# Altium schematic sheet Power.SchDoc
size 420 x 297 mm; DocumentNumber: Power supply
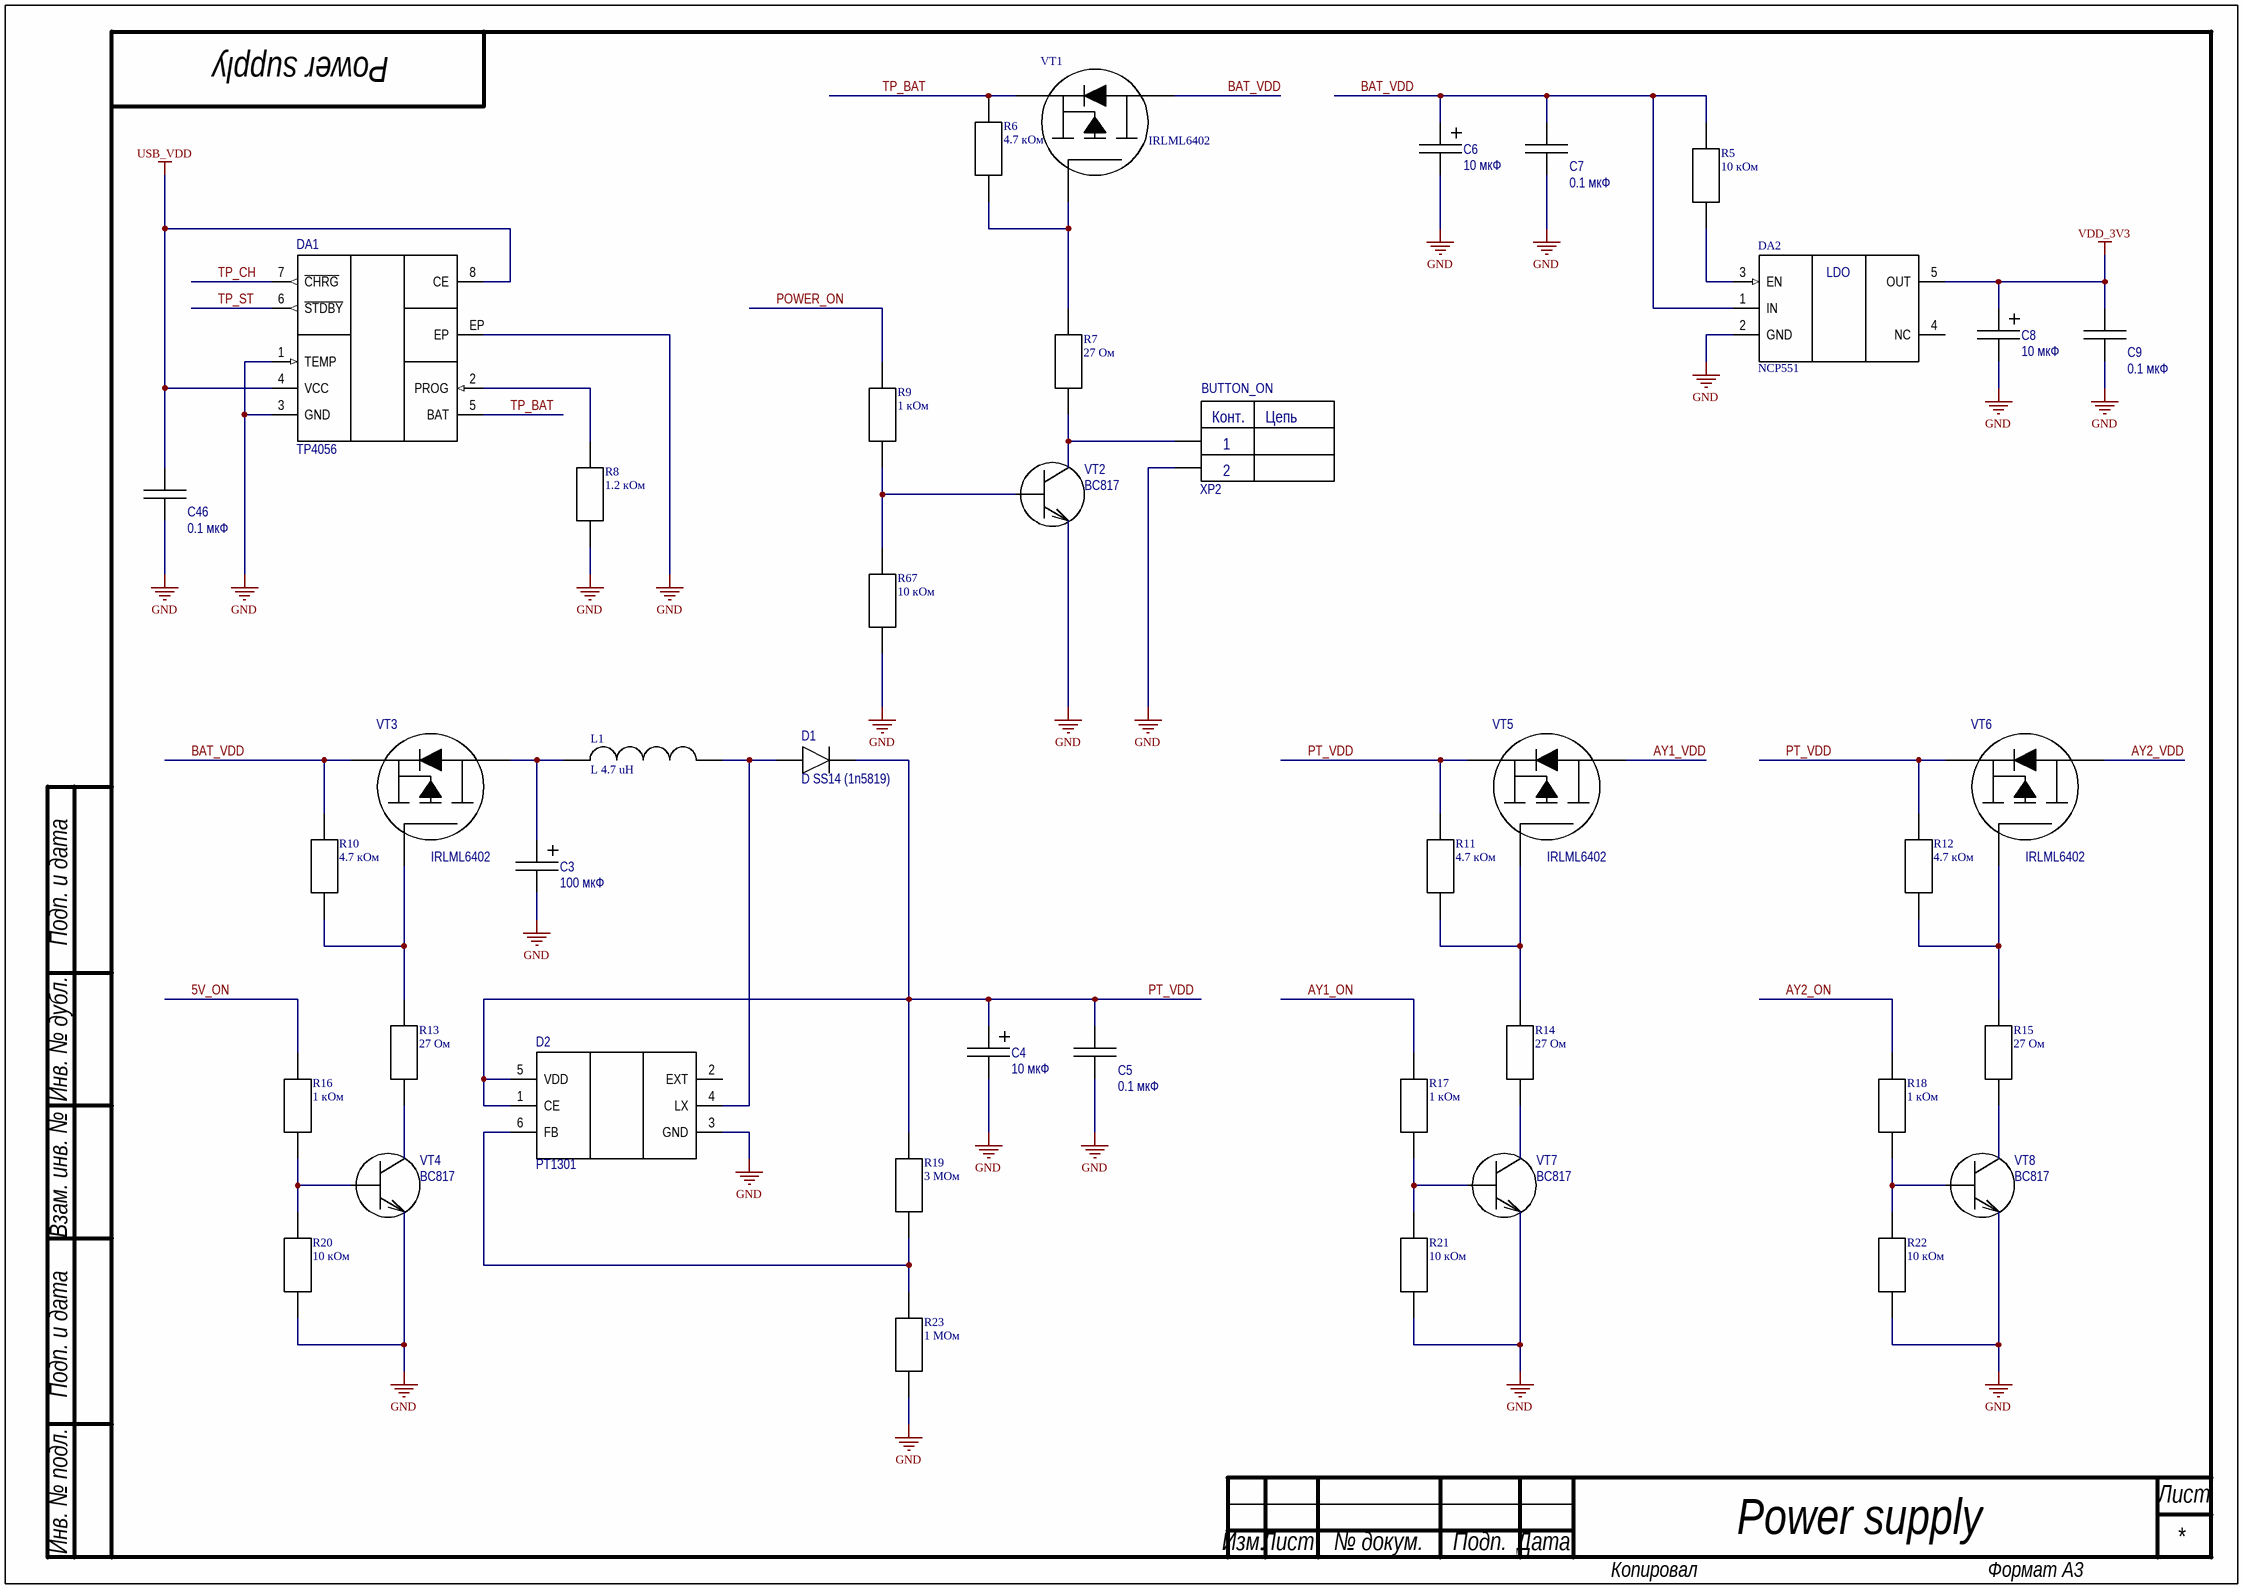
[diagram p0: Power.SchDoc]

## Parts
C3  100 мкФ  [C TAN_D]
C4  10 мкФ  [C TAN_C]
C5  0.1 мкФ  [C 1206]
C6  10 мкФ  [C TAN_C]
C7  0.1 мкФ  [C 1206]
C8  10 мкФ  [C TAN_C]
C9  0.1 мкФ  [C 1206]
C46  0.1 мкФ  [C 1206]
D1  D SS14 (1n5819)  [SMA/DO-214AC]
D2  PT1301  [SOT-23-6]
DA1  TP4056  [HSOP-8]
DA2  NCP551  [TSOP-5]
L1  L 4.7 uH  [CD43]
R5  10 кОм  [RES 0805]
R6  4.7 кОм  [RES 0805]
R7  27 Ом  [RES 0805]
R8  1.2 кОм  [RES 0805]
R9  1 кОм  [RES 0805]
R10  4.7 кОм  [RES 0805]
R11  4.7 кОм  [RES 0805]
R12  4.7 кОм  [RES 0805]
R13  27 Ом  [RES 0805]
R14  27 Ом  [RES 0805]
R15  27 Ом  [RES 0805]
R16  1 кОм  [RES 0805]
R17  1 кОм  [RES 0805]
R18  1 кОм  [RES 0805]
R19  3 МОм  [RES 0805]
R20  10 кОм  [RES 0805]
R21  10 кОм  [RES 0805]
R22  10 кОм  [RES 0805]
R23  1 МОм  [RES 0805]
R67  10 кОм  [RES 0805]
VT1  IRLML6402  [SOT-23]
VT2  BC817  [SOT-23]
VT3  IRLML6402  [SOT-23]
VT4  BC817  [SOT-23]
VT5  IRLML6402  [SOT-23]
VT6  IRLML6402  [SOT-23]
VT7  BC817  [SOT-23]
VT8  BC817  [SOT-23]
XP2  PLS-2  [PLS-2]  (value not drawn)

## Nets
GND: C3.2 C4.2 C5.2 C6.2 C7.2 C8.2 C9.2 C46.2 D2.3(GND) DA1.1(TEMP) DA1.3(GND) DA1.EP DA2.2(GND) R8.1 R20.1 R21.1 R22.1 R23.1 R67.1 VT2.2(E) VT4.2(E) VT7.2(E) VT8.2(E) XP2.2
USB_VDD: C46.1 DA1.4(VCC) DA1.8(CE)
VDD_3V3: C8.1 C9.1 DA2.5(OUT)
5V_ON: R16.2
AY1_ON: R17.2
AY1_VDD: VT5.3(D)
AY2_ON: R18.2
AY2_VDD: VT6.3(D)
BAT_VDD: C6.1 C7.1 DA2.1(IN) R5.2 R10.2 VT1.3(D) VT3.2(S)
POWER_ON: R9.2
PT_VDD: C4.1 C5.1 D1.C D2.1(CE) D2.5(VDD) R11.2 R12.2 R19.2 VT5.2(S) VT6.2(S)
TP_BAT: DA1.5(BAT) R6.2 VT1.2(S)
TP_CH: DA1.7(~{CHRG})
TP_ST: DA1.6(~{STDBY})
NetC3_1: C3.1 L1.1 VT3.3(D)
NetD1_A: D1.A D2.4(LX) L1.2
NetD2_6: D2.6(FB) R19.1 R23.2
NetDA1_2: DA1.2(PROG) R8.2
NetDA2_3: DA2.3(EN) R5.1
NetR6_1: R6.1 R7.2 VT1.1(G)
NetR7_1: R7.1 VT2.3(C) XP2.1
NetR9_1: R9.1 R67.2 VT2.1(B)
NetR10_1: R10.1 R13.2 VT3.1(G)
NetR11_1: R11.1 R14.2 VT5.1(G)
NetR12_1: R12.1 R15.2 VT6.1(G)
NetR13_1: R13.1 VT4.3(C)
NetR14_1: R14.1 VT7.3(C)
NetR15_1: R15.1 VT8.3(C)
NetR16_1: R16.1 R20.2 VT4.1(B)
NetR17_1: R17.1 R21.2 VT7.1(B)
NetR18_1: R18.1 R22.2 VT8.1(B)

Not connected (* = marked no-connect by the designer): D2 2(EXT); DA2 4(NC)

## Notes on the sheet
- (near XP2) BUTTON_ON
- Подп. и дата
- Инв. № дубл.
- Взам. инв. №
- Инв. № подл.
- Лист
- Изм.
- № докум.
- Подп.
- Дата
- Копировал
- Формат А3
- (in symbol NCP551) LDO
- (in symbol PLS-2) Конт.; Цепь

## Library data of the parts
C3 = CAP TAN_D: SMD Tantalium Capacitor D; Manufacturer: /Укажите компанию-производителя/; Tolerance: /Укажите допуск в процентах/; Type: Конденсатор танталовый; ESR: /Укажите значение ЭПС/; Rated voltage: 10 В; Size: D; Temperature range: /Формат: -? ... ? °C/; Value: 100 мкФ
C4 C6 C8 = CAP TAN_C: SMD Tantalium Capacitor C; Manufacturer: /Укажите компанию-производителя/; Tolerance: /Укажите допуск в процентах/; Type: Конденсатор танталовый; ESR: /Укажите значение ЭПС/; Size: C; Temperature range: /Формат: -? ... ? °C/; Value: 10 мкФ
C5 C7 C9 C46 = CAP 1206: SMD Capacitor 1206; Manufacturer: /Укажите компанию-производителя/; Tolerance: /Укажите допуск в процентах/; Temperature coefficient: /Формат: ±? ppm/°C/; Type: Конденсатор керамический; TC: /Укажите тип диэлектрика/; Size: 1206; Temperature range: /Формат: -? ... ? °C/; Value: 0.1 мкФ
D2 = PT1301: DC-DC step-up (повышающий) PT1301 в корпусе SOT23-6.
L1 = L 4.7 uH: Катушка индуктивности 4.7 мкГн корпус CD43 (индуктивность 4.7 uH).
R5-R23 R67 = RES 0805
VT2 VT4 VT7 VT8 = BC817: NPN general-purpose transistor; Manufacturer: NXP; Structure: n-p-n; Type: Транзистор биполярный; hFE: 160 ... 600; Max collector-emitter voltage: 45 В; Max collector-base voltage: 50 В; Max emitter-base voltage: 5 В; Max collector current: 0,5 А; Max collector peak current: 1 А; Power dissitipation: 0,25 Вт; fT: 100 МГц; Collector-emitter saturation voltage: 0,7 В; Base-emitter on voltage: 1,2 В; Specitication: ЭКБ ИП; Collector-base сapacitance: 3 пФ; Complement: BC807; Temperature range: -65 ... 150 °C
XP2 = PLS-2: PLS connector; Manufacturer: NONAME; Connector type: Вилка на плату; Number of contacts: 2; Type: Разъем штыревой